# Altium schematic sheet Offset Compensator.SchDoc
size Letter; SheetNumber: 4; SheetTotal: 14
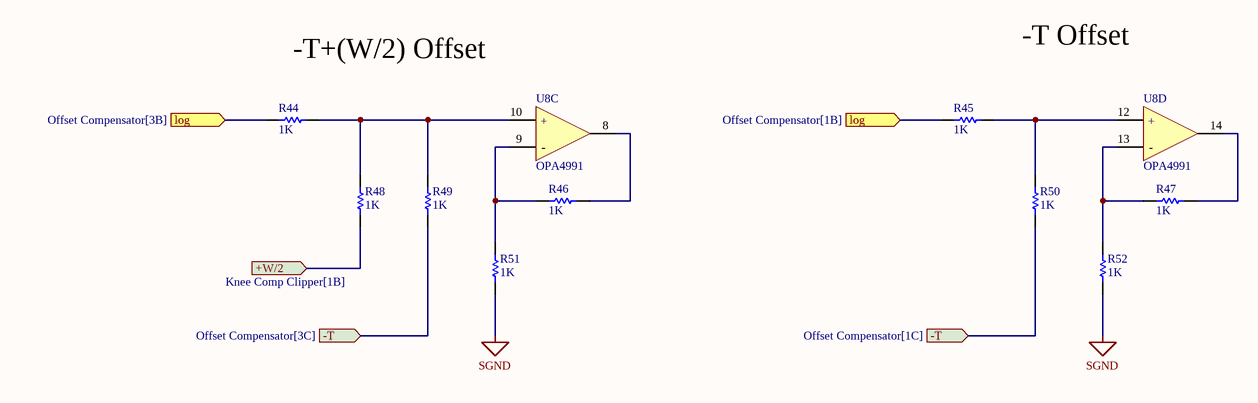
[diagram p0: Offset Compensator.SchDoc]

## Parts
R44  value 1K  (hidden comment: Resistor)
R45  value 1K  (hidden comment: Resistor)
R46  value 1K  (hidden comment: Resistor)
R47  value 1K  (hidden comment: Resistor)
R48  value 1K  (hidden comment: Resistor)
R49  value 1K  (hidden comment: Resistor)
R50  value 1K  (hidden comment: Resistor)
R51  value 1K  (hidden comment: Resistor)
R52  value 1K  (hidden comment: Resistor)
U8  OPA4991  [FP-D0014A-IPC_B]  (parts C,D of 5)

## Ports
+W/2 (in, see Knee Comp Clipper[1B]), -T (in, see Offset Compensator[1C]), -T (in, see Offset Compensator[3C]), log (in, see Offset Compensator[1B]), log (in, see Offset Compensator[3B])

## Nets
SGND: R51.2 R52.2
+W/2: R48.1 ; port +W/2
-T: R49.1 R50.1 ; port -T
log: R44.1 R45.1 ; port log
NetR44_2: R44.2 R48.2 R49.2 U8.10(IN3+)
NetR45_2: R45.2 R50.2 U8.12(IN4+)
NetR46_1: R46.1 U8.8(OUT3)
NetR46_2: R46.2 R51.1 U8.9(IN3-)
NetR47_1: R47.1 U8.14(OUT4)
NetR47_2: R47.2 R52.1 U8.13(IN4-)

## Notes on the sheet
- -T+(W/2) Offset
- -T Offset
- (in symbol OPA4991IDR, part C) +; -
- (in symbol OPA4991IDR, part D) +; -

## Library data of the parts
R44-R52 = Resistor: TC1: 0; SimulationGenericComponent: True; TC2: 0
U8 = OPA4991IDR: 40-V, DUAL 4.5MHZ, RAIL-TO-RAIL